# EasyEDA schematic 1-Schematic_slime.json
TITLE: Sheet_1; REV: 1.0; Date: 2025-02-09; Sheet: 1/1; Drawn By: tarasusthelight; Company: Your Company
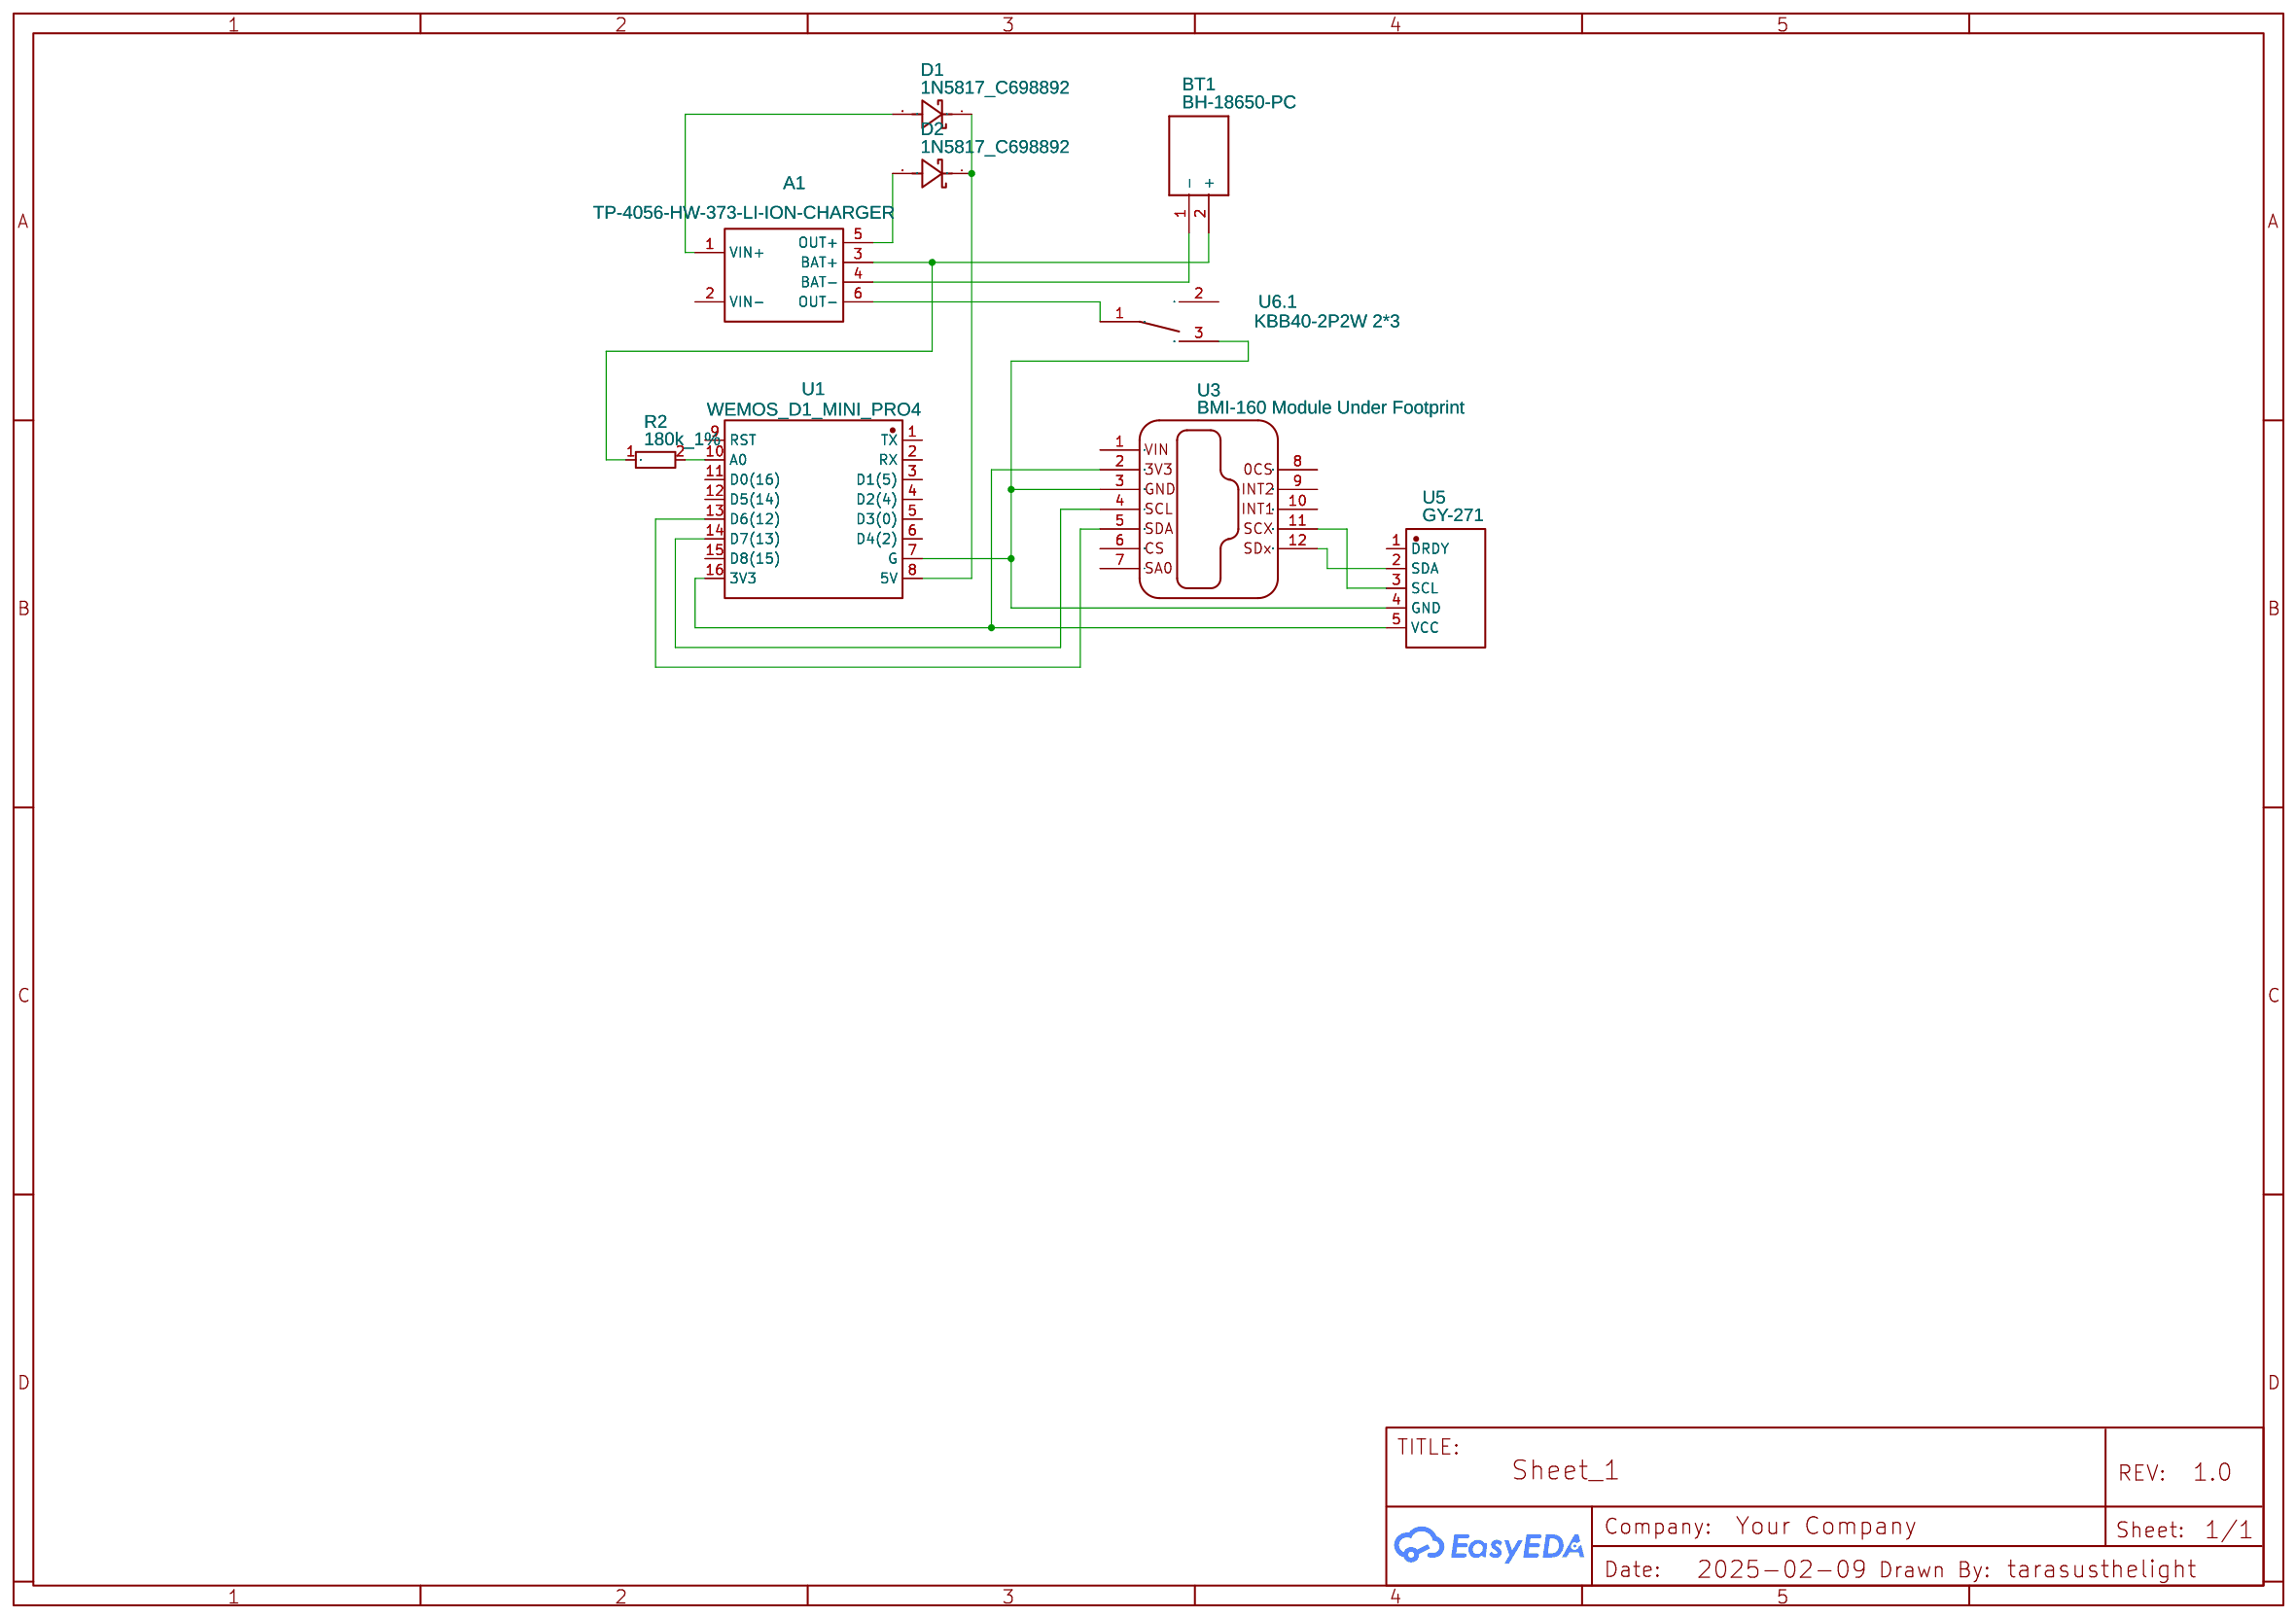
[diagram p0: schematic sheet]

## Parts
A1  TP-4056-HW-373-LI-ION-CHARGER  [TP-4056-HW-373-LI-ION-CHANGER]
BT1  BH-18650-PC  [BH18650PC]
D1  1N5817_C698892  [DO-41_BD2.4-L4.7-P8.70-D0.9-RD]
D2  1N5817_C698892  [DO-41_BD2.4-L4.7-P8.70-D0.9-RD]
R2  180k_1%  [RESISTOR_THT_12,7MM]
U1  WEMOS_D1_MINI_PRO4  [DIP-16_WEMOS_D1_MINI_PRO4]
U3  BMI-160 Module Under Footprint  [BMI-160 MODULE UNDER FOOTPRINT]
U5  GY-271  [GY-271]
U6  KBB40-2P2W 2*3  [KBB40-2P2W]  (section 1)

## Library data of the parts
A1 = TP-4056-HW-373-LI-ION-CHARGER: Contributor: Citisenx
BT1 = BH-18650-PC: Contributor: fepblaster
D1 D2 = 1N5817_C698892: Contributor: LCSC; Supplier: LCSC; Supplier Part: C698892; Manufacturer: YANGJIE(扬杰); Manufacturer Part: 1N5817; JLCPCB Part Class: Extended Part
R2 = 180k_1%_THT: Supplier: LCSC; Supplier Part: C172975; Manufacturer: YAGEO; Manufacturer Part: MFR-25FTE52-180K; JLCPCB Part Class: Extended Part; link: https://www.lcsc.com/datasheet/lcsc_datasheet_2304140030_YAGEO-MFR-25FTE52-150K_C172972.pdf
U1 = WEMOS_D1_MINI_PRO4: Contributor: LCSC; Supplier: LCSC; Supplier Part: C2837266; Manufacturer: null; Manufacturer Part: Wemos_D1_mini_Pro4; JLCPCB Part Class: Extended Part
U3 = BMI-160 Module Under Footprint: Contributor: Cocaine
U5 = GY-271: Contributor: MySelf9911
U6 = KBB40-2P2W 2*3: Contributor: ggenn; subpart_no: 1

## Nets
Net-(A1-1): A1.1(VIN+) D1.2
Net-(A1-3): A1.3(BAT+) BT1.2(+) R2.1
Net-(A1-4): A1.4(BAT-) BT1.1(-)
Net-(A1-5): A1.5(OUT+) D2.2
Net-(A1-6): A1.6(OUT-) U6.1
Net-(D1-1): D1.1 D2.1 U1.8(5V)
Net-(R2-2): R2.2 U1.10(A0)
Net-(U1-7): U1.7(G) U3.3 U5.4(GND) U6.3
Net-(U1-13): U1.13(D6(12)) U3.5
Net-(U1-14): U1.14(D7(13)) U3.4
Net-(U1-16): U1.16(3V3) U3.2 U5.5(VCC)
Net-(U3-11): U3.11 U5.3(SCL)
Net-(U3-12): U3.12 U5.2(SDA)

Not connected (* = marked no-connect by the designer): A1 2(VIN-); U1 1(TX) 2(RX) 3(D1(5)) 4(D2(4)) 5(D3(0)) 6(D4(2)) 9(RST) 11(D0(16)) 12(D5(14)) 15(D8(15)); U3 1 6 7 8 9 10; U5 1(DRDY); U6 2
